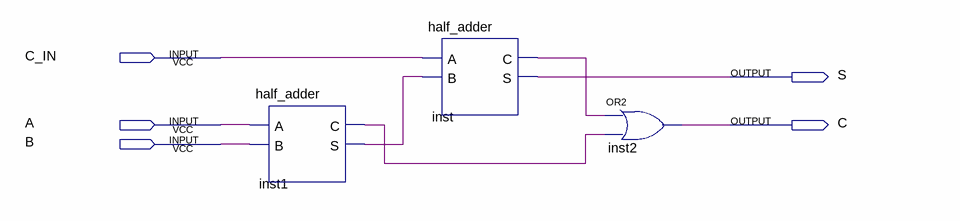
[diagram p0: schematic sheet]
// Quartus schematic full_adder.bdf as structural Verilog: 3 symbols, 5 pins
module full_adder (
  input  C_IN,
  input  A,
  input  B,
  output S,
  output C
);

  wire inst1_c, inst1_s, inst_c;

  half_adder inst1 (.A(A), .B(B), .C(inst1_c), .S(inst1_s));
  half_adder inst (.A(C_IN), .B(inst1_s), .C(inst_c), .S(S));
  or inst2 (C, inst_c, inst1_c);
endmodule
